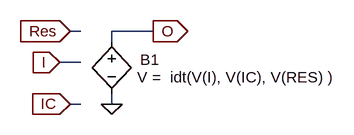
[diagram p0: schematic integrator_module.asc]
integrator_module.asc, the LTspice schematic file:
Version 4
SHEET 1 880 680
WIRE 128 160 112 160
WIRE 240 160 176 160
WIRE 176 176 176 160
WIRE 128 208 96 208
WIRE 128 272 112 272
WIRE 176 272 176 256
FLAG 96 208 I
IOPIN 96 208 In
FLAG 176 272 0
FLAG 240 160 O
IOPIN 240 160 Out
FLAG 112 272 IC
IOPIN 112 272 In
FLAG 112 160 Res
IOPIN 112 160 In
SYMBOL bv 176 160 R0
WINDOW 0 44 44 Left 0
WINDOW 3 39 71 Left 0
SYMATTR InstName B1
SYMATTR Value V =  idt(V(I), V(IC), V(RES) )

The netlist it stands for:
* integrator_module.asc
B1 O 0 V =  idt(V(I), V(IC), V(RES) )
.backanno
.end